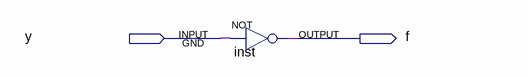
[diagram p0: schematic sheet]
// Quartus schematic 1-2-3.bdf as structural Verilog: 1 symbols, 2 pins
module \1-2-3  (
  input  y,
  output f
);

  not inst (f, y);
endmodule
